# Altium schematic sheet eMMC.SchDoc
size 297 x 209 mm; SheetNumber: 14; SheetTotal: 32
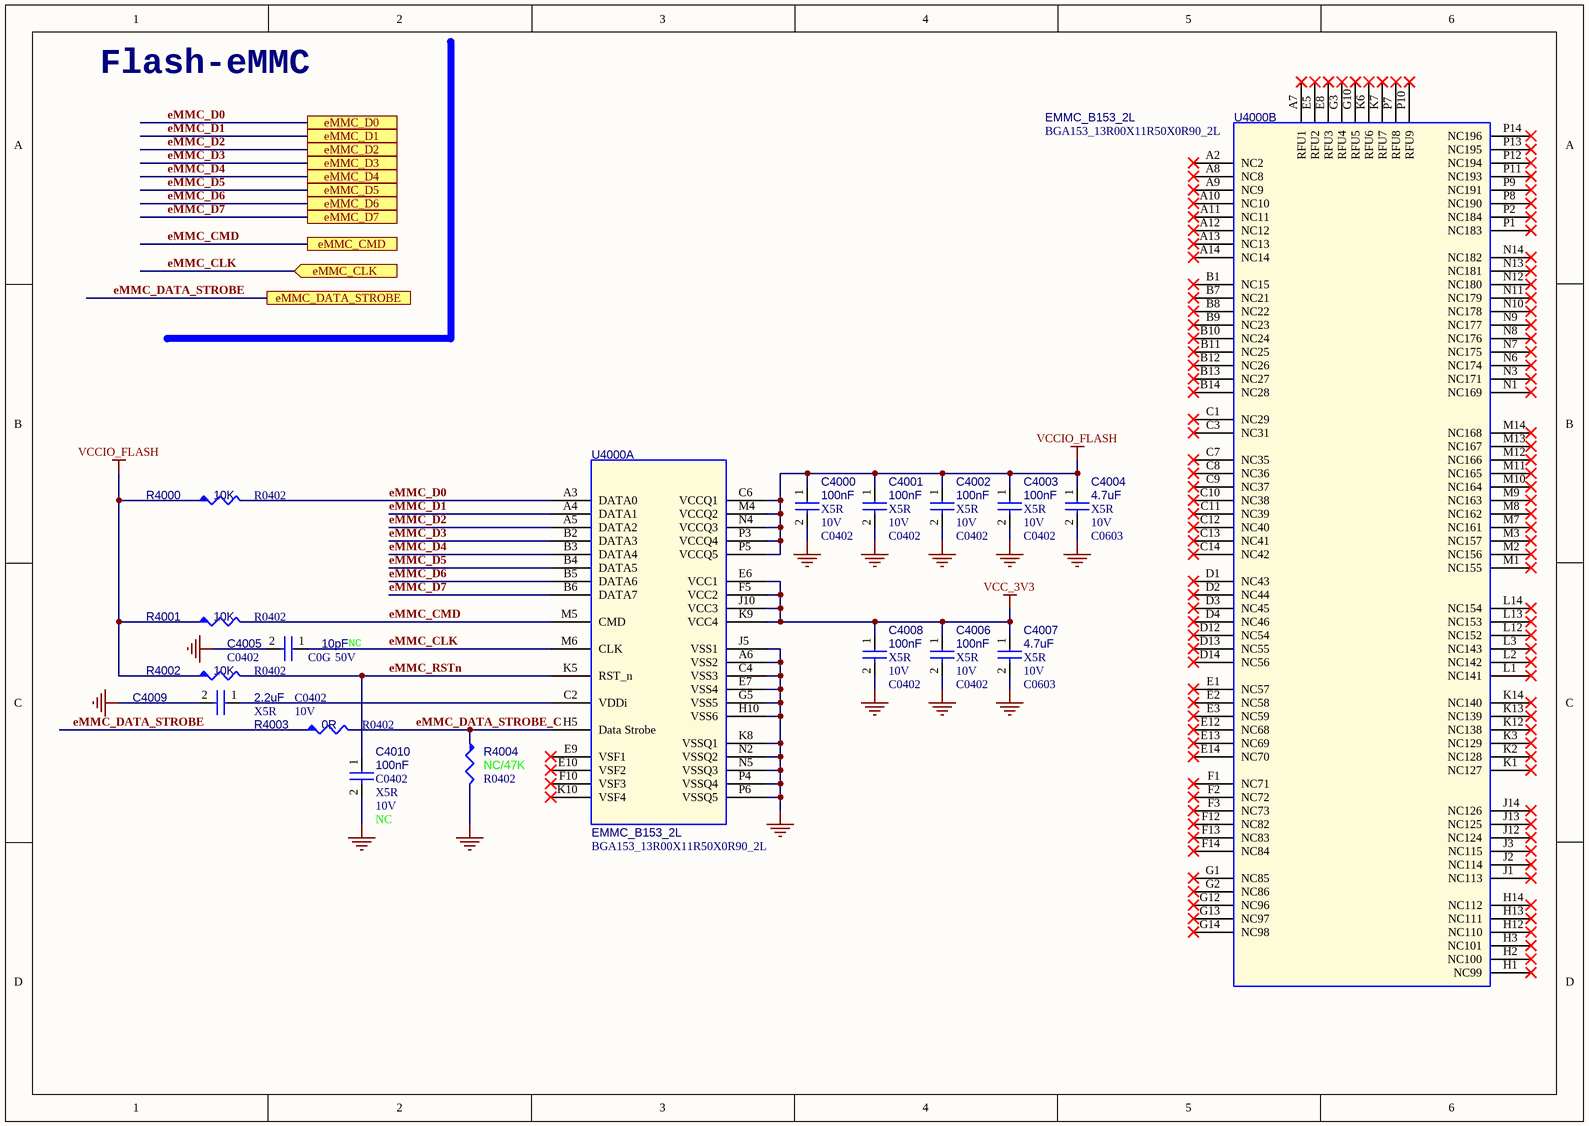
[diagram p0: eMMC.SchDoc]

## Parts
C4000  100nF  Dielectric: X5R  Voltage: 10V  [C0402]
C4001  100nF  Dielectric: X5R  Voltage: 10V  [C0402]
C4002  100nF  Dielectric: X5R  Voltage: 10V  [C0402]
C4003  100nF  Dielectric: X5R  Voltage: 10V  [C0402]
C4004  4.7uF  Dielectric: X5R  Voltage: 10V  [C0603]
C4005  10pF  Dielectric: C0G  Voltage: 50V  option: NC  [C0402]
C4006  100nF  Dielectric: X5R  Voltage: 10V  [C0402]
C4007  4.7uF  Dielectric: X5R  Voltage: 10V  [C0603]
C4008  100nF  Dielectric: X5R  Voltage: 10V  [C0402]
C4009  2.2uF  Dielectric: X5R  Voltage: 10V  [C0402]
C4010  100nF  Dielectric: X5R  Voltage: 10V  option: NC  [C0402]
R4000  10K  [R0402]
R4001  10K  [R0402]
R4002  10K  [R0402]
R4003  0R  [R0402]
R4004  NC/47K  [R0402]
U4000  EMMC_B153_2L  PCB Footprint: BGA153_13R00X11R50X0R90_2L  [FBGA-153_L13.0-W11.5-P0.50_KLMAG1JETD-B041]  (parts A,B of 2)

## Ports
eMMC_CLK (in, see CONTROLLER-RK3562[3A], RK3562-VCCIO2-VCCIO3[3B]), eMMC_CMD (see CONTROLLER-RK3562[3A], RK3562-VCCIO2-VCCIO3[3A]), eMMC_D0 (see CONTROLLER-RK3562[3A], RK3562-VCCIO2-VCCIO3[3A]), eMMC_D1 (see CONTROLLER-RK3562[3A], RK3562-VCCIO2-VCCIO3[3A]), eMMC_D2 (see CONTROLLER-RK3562[3A], RK3562-VCCIO2-VCCIO3[3A]), eMMC_D3 (see CONTROLLER-RK3562[3A], RK3562-VCCIO2-VCCIO3[3A]), eMMC_D4 (see CONTROLLER-RK3562[3A], RK3562-VCCIO2-VCCIO3[3A]), eMMC_D5 (see CONTROLLER-RK3562[3A], RK3562-VCCIO2-VCCIO3[3A]), eMMC_D6 (see CONTROLLER-RK3562[3A], RK3562-VCCIO2-VCCIO3[3A]), eMMC_D7 (see CONTROLLER-RK3562[3A], RK3562-VCCIO2-VCCIO3[3A]), eMMC_DATA_STROBE (see CONTROLLER-RK3562[3A], RK3562-VCCIO2-VCCIO3[3B])

## Nets
GND: C4000.2 C4001.2 C4002.2 C4003.2 C4004.2 C4005.2 C4006.2 C4007.2 C4008.2 C4009.2 C4010.2 R4004.2 U4000.A6(VSS2) U4000.C4(VSS3) U4000.E7(VSS4) U4000.G5(VSS5) U4000.H10(VSS6) U4000.J5(VSS1) U4000.K8(VSSQ1) U4000.N2(VSSQ2) U4000.N5(VSSQ3) U4000.P4(VSSQ4) U4000.P6(VSSQ5)
VCC_3V3: C4006.1 C4007.1 C4008.1 U4000.E6(VCC1) U4000.F5(VCC2) U4000.J10(VCC3) U4000.K9(VCC4)
VCCIO_FLASH: C4000.1 C4001.1 C4002.1 C4003.1 C4004.1 R4000.1 R4001.1 R4002.1 U4000.C6(VCCQ1) U4000.M4(VCCQ2) U4000.N4(VCCQ3) U4000.P3(VCCQ4) U4000.P5(VCCQ5)
eMMC_CLK: C4005.1 U4000.M6(CLK) ; port eMMC_CLK
eMMC_CMD: R4001.2 U4000.M5(CMD) ; port eMMC_CMD
eMMC_D0: R4000.2 U4000.A3(DATA0) ; port eMMC_D0
eMMC_D1: U4000.A4(DATA1) ; port eMMC_D1
eMMC_D2: U4000.A5(DATA2) ; port eMMC_D2
eMMC_D3: U4000.B2(DATA3) ; port eMMC_D3
eMMC_D4: U4000.B3(DATA4) ; port eMMC_D4
eMMC_D5: U4000.B4(DATA5) ; port eMMC_D5
eMMC_D6: U4000.B5(DATA6) ; port eMMC_D6
eMMC_D7: U4000.B6(DATA7) ; port eMMC_D7
eMMC_DATA_STROBE: R4003.1 ; port eMMC_DATA_STROBE
eMMC_DATA_STROBE_C: R4003.2 R4004.1 U4000.H5(Data_Strobe)
eMMC_RSTn: C4010.1 R4002.2 U4000.K5(RST_n)
NetC4009_1: C4009.1 U4000.C2(VDDi)

Not connected (* = marked no-connect by the designer): U4000 A2(NC2)* A7(RFU1)* A8(NC8)* A9(NC9)* A10(NC10)* A11(NC11)* A12(NC12)* A13(NC13)* A14(NC14)* B1(NC15)* B7(NC21)* B8(NC22)* B9(NC23)* B10(NC24)* B11(NC25)* B12(NC26)* B13(NC27)* B14(NC28)* C1(NC29)* C3(NC31)* C7(NC35)* C8(NC36)* C9(NC37)* C10(NC38)* C11(NC39)* C12(NC40)* C13(NC41)* C14(NC42)* D1(NC43)* D2(NC44)* D3(NC45)* D4(NC46)* D12(NC54)* D13(NC55)* D14(NC56)* E1(NC57)* E2(NC58)* E3(NC59)* E5(RFU2)* E8(RFU3)* E9(VSF1)* E10(VSF2)* E12(NC68)* E13(NC69)* E14(NC70)* F1(NC71)* F2(NC72)* F3(NC73)* F10(VSF3)* F12(NC82)* F13(NC83)* F14(NC84)* G1(NC85)* G2(NC86)* G3(RFU4)* G10(RFU5)* G12(NC96)* G13(NC97)* G14(NC98)* H1(NC99)* H2(NC100)* H3(NC101)* H12(NC110)* H13(NC111)* H14(NC112)* J1(NC113)* J2(NC114)* J3(NC115)* J12(NC124)* J13(NC125)* J14(NC126)* K1(NC127)* K2(NC128)* K3(NC129)* K6(RFU6)* K7(RFU7)* K10(VSF4)* K12(NC138)* K13(NC139)* K14(NC140)* L1(NC141)* L2(NC142)* L3(NC143)* L12(NC152)* L13(NC153)* L14(NC154)* M1(NC155)* M2(NC156)* M3(NC157)* M7(NC161)* M8(NC162)* M9(NC163)* M10(NC164)* M11(NC165)* M12(NC166)* M13(NC167)* M14(NC168)* N1(NC169)* N3(NC171)* N6(NC174)* N7(NC175)* N8(NC176)* N9(NC177)* N10(NC178)* N11(NC179)* N12(NC180)* N13(NC181)* N14(NC182)* P1(NC183)* P2(NC184)* P7(RFU8)* P8(NC190)* P9(NC191)* P10(RFU9)* P11(NC193)* P12(NC194)* P13(NC195)* P14(NC196)*

## Notes on the sheet
- Flash-eMMC

## Library data of the parts
C4000 = CAP NP: cap,100.00nF,+/-10%,10V,X5R,C0402; Part Reference: C4000; Manufacturer PN: C1005X5R1A104K050BA; Manufacturer: TDK; Tolerance: 10%; Priority: A; PCB Footprint: C0402; Value: 100nF; Created by: JJJ; Part Type: C0402; RK PN: C1005X5R1A104K050BA; ClassName: RK
C4001 = CAP NP: cap,100.00nF,+/-10%,10V,X5R,C0402; Part Reference: C4001; Manufacturer: TDK; RK PN: C1005X5R1A104K050BA; Priority: A; Tolerance: 10%; PCB Footprint: C0402; Value: 100nF; Part Type: C0402; Manufacturer PN: C1005X5R1A104K050BA; Created by: JJJ; ClassName: RK
C4002 = CAP NP: cap,100.00nF,+/-10%,10V,X5R,C0402; Part Reference: C4002; Manufacturer: TDK; RK PN: C1005X5R1A104K050BA; Priority: A; Tolerance: 10%; PCB Footprint: C0402; Value: 100nF; Part Type: C0402; Manufacturer PN: C1005X5R1A104K050BA; Created by: JJJ; ClassName: RK
C4003 = CAP NP: cap,100.00nF,+/-10%,10V,X5R,C0402; Part Reference: C4003; Manufacturer PN: C1005X5R1A104K050BA; Manufacturer: TDK; Tolerance: 10%; Priority: A; PCB Footprint: C0402; Value: 100nF; Created by: JJJ; Part Type: C0402; RK PN: C1005X5R1A104K050BA; ClassName: RK
C4004 = CAP NP: cap,4.70uF,+/-10%,10V,X5R,C0603; Part Reference: C4004; Manufacturer: TDK; Number: 37; RK PN: C1608X5R1A475K080AC; Priority: A; Tolerance: 10%; C_Voltage: 6.3V; PCB Footprint: C0603; Value: 4.7uF; Part Type: C0603; Manufacturer PN: C1608X5R1A475K080AC; Created by: JJJ; ClassName: RK
C4005 = CAP NP: cap,10.00pF,+/-0.5,50V,C0G,C0402; Part Reference: C4005; Manufacturer: TDK; RK PN: C1005C0G1H100D050BA; Priority: A; Tolerance: +/-0.5pF; PCB Footprint: C0402; Value: 10pF; Part Type: C0402; Manufacturer PN: C1005C0G1H100D050BA; Created by: JJJ; ClassName: RK
C4006 = CAP NP: cap,100.00nF,+/-10%,10V,X5R,C0402; Part Reference: C4006; Manufacturer PN: C1005X5R1A104K050BA; Manufacturer: TDK; Tolerance: 10%; Priority: A; PCB Footprint: C0402; Value: 100nF; Created by: JJJ; Part Type: C0402; RK PN: C1005X5R1A104K050BA; ClassName: RK
C4007 = CAP NP: cap,4.70uF,+/-10%,10V,X5R,C0603; Part Reference: C4007; Manufacturer: TDK; Number: 37; RK PN: C1608X5R1A475K080AC; Priority: A; Tolerance: 10%; C_Voltage: 6.3V; PCB Footprint: C0603; Value: 4.7uF; Part Type: C0603; Manufacturer PN: C1608X5R1A475K080AC; Created by: JJJ; ClassName: RK
C4008 = CAP NP: cap,100.00nF,+/-10%,10V,X5R,C0402; Part Reference: C4008; Manufacturer PN: C1005X5R1A104K050BA; Manufacturer: TDK; Tolerance: 10%; Priority: A; PCB Footprint: C0402; Value: 100nF; Created by: JJJ; Part Type: C0402; RK PN: C1005X5R1A104K050BA; ClassName: RK
C4009 = CAP NP: cap,2.20uF,+/-10%,10V,X5R,C0402; Part Reference: C4009; Manufacturer: TDK; RK PN: C1005X5R1A225K050BC; Priority: A; Tolerance: 10%; PCB Footprint: C0402; Value: 2.2uF; Part Type: C0402; Manufacturer PN: C1005X5R1A225K050BC; Created by: JJJ; ClassName: RK
C4010 = CAP NP: cap,100.00nF,+/-10%,10V,X5R,C0402; Part Reference: C4010; Manufacturer PN: C1005X5R1A104K050BA; Manufacturer: TDK; Tolerance: 10%; Priority: A; PCB Footprint: C0402; Value: 100nF; Created by: JJJ; Part Type: C0402; RK PN: C1005X5R1A104K050BA; ClassName: RK
R4000 = RESISTOR5: 通用厚膜电阻,10K,+/-5%,R0402,1/16W.; Part Reference: R4000; Manufacturer PN: RC0402JR-0710KL; Manufacturer: YAGEO; Tolerance: 5%; Wattage: 1/16W; Priority: A; RK PN: 901001449; PCB Footprint: R0402; Value: 10K; Created by: YTL; Part Type: 通用厚膜电阻; ClassName: RK
R4001 = RESISTOR5: 通用厚膜电阻,10K,+/-5%,R0402,1/16W.; Part Reference: R4001; Manufacturer PN: RC0402JR-0710KL; Manufacturer: YAGEO; Tolerance: 5%; Wattage: 1/16W; Priority: A; RK PN: 901001449; PCB Footprint: R0402; Value: 10K; Created by: YTL; Part Type: 通用厚膜电阻; ClassName: RK
R4002 = RESISTOR5: 通用厚膜电阻,10K,+/-5%,R0402,1/16W.; Part Reference: R4002; Manufacturer PN: RC0402JR-0710KL; Manufacturer: YAGEO; Tolerance: 5%; Wattage: 1/16W; Priority: A; RK PN: 901001449; PCB Footprint: R0402; Value: 10K; Created by: YTL; Part Type: 通用厚膜电阻; ClassName: RK
R4003 = RESISTOR5: 通用厚膜电阻,0R,+/-5%,R0402,1/16W.; Part Reference: R4003; Manufacturer PN: RC0402JR-070RL; Manufacturer: YAGEO; Tolerance: 5%; Wattage: 1/16W; Priority: A; RK PN: 901001446; PCB Footprint: R0402; Value: 0R; Created by: YTL; Part Type: 通用厚膜电阻; ClassName: RK
R4004 = RESISTOR5_NC: 通用厚膜电阻,47K,+/-5%,R0402,1/16W.; Part Reference: R4004; Manufacturer: YAGEO; Manufacturer PN: RC0402JR-0747KL; Tolerance: 5%; RK PN: 901001559-1; Priority: A; Wattage: 1/16W; Optional: X; PCB Footprint: R0402; Value: NC/47K; Part Type: 通用厚膜电阻; Created by: YTL; ClassName: RK
U4000 = INAND_EMMC_153_2L: EMMC_B153_2L,更好的满足工艺需求，Fanout方式部分走线跨接再球位上，挖除A1\C5球位; Part Reference: U4000; Priority: A; Value: EMMC_B153_2L; Created by: YWQ; Part Type: NAND_FLASH; RK PN: EMMC_B153_2L; ClassName: RK